# EAGLE design BUZZI-37 (EAGLE 4.15)
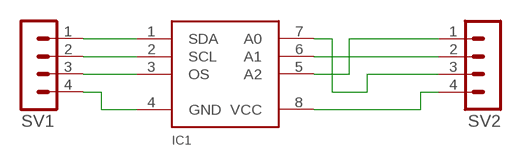
[diagram p0: schematic, sheet 1]

## Parts
IC1  SE95  [MSOP8]
SV1  MA04-1  [MA04-1]
SV2  MA04-1  [MA04-1]

## Nets
N$1: IC1.1(SDA) SV1.1
N$2: IC1.2(SCL) SV1.2
N$3: IC1.3(OS) SV1.3
N$4: IC1.4(GND) SV1.4
N$5: IC1.5(A2) SV2.1
N$6: IC1.6(A1) SV2.2
N$7: IC1.7(A0) SV2.3
N$8: IC1.8(VCC) SV2.4

## Library data of the parts
IC1 = turbod3:SE95
SV1 SV2 = con-lstb:MA04-1: PIN HEADER

## Board
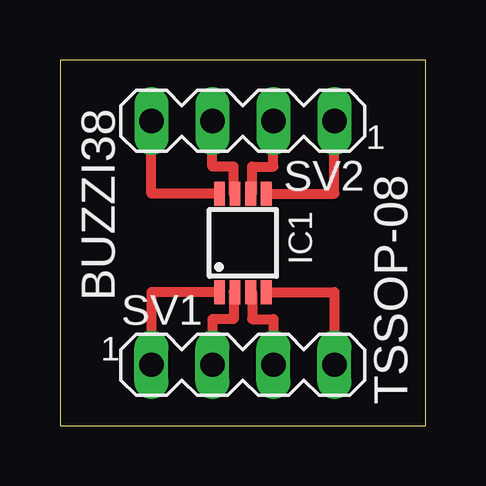
[diagram p1: board, top side]

Size 15.24 x 15.24 mm. Coordinates in mm from the lower left corner, seen from the top.
Outline: 0,0 15.24,0 15.24,15.24 0,15.24 0,0
Copper layers (1*16): Top 0.035mm / dielectric 1.5mm / Bottom 0.035mm
Design rules "PCB-POOL": minimum track width 6mil, minimum drill 12mil, track to track 6mil, track to pad 6mil, pad to pad 6mil, via to via 6mil, smd to smd 6mil, copper to edge 20mil, drill to drill 8mil, minimum pad ring 8mil, minimum via ring 6mil, stop-mask expansion 3mil, vias tented up to drill 0mil, thermal gap 8mil

### Footprints (pad centres in the part's own frame; a part is rotated, then mirrored left to right if it is on the bottom)
MSOP8 = smd 0.45 x 1: 1 -0.975,-2.05; 2 -0.325,-2.05; 3 0.325,-2.05; 4 0.975,-2.05; 5 0.975,2.05; 6 0.325,2.05; 7 -0.325,2.05; 8 -0.975,2.05
MA04-1 = drill 1.016 long: 1 -3.81,0; 2 -1.27,0; 3 1.27,0; 4 3.81,0

### Placement (x,y rotation side)
IC1  7.62,7.62 0 top
SV1  7.62,2.54 0 top
SV2  7.62,12.7 180 top

### Tracks (layer width: path | path; a pad name or v marks a point on that pad's centre or on a via)
N$1
  Top 0.406: 3.81,2.29 SV1.1 3.81,5.57 IC1.1
N$2
  Top 0.406: IC1.2 7.24,5.57 7.24,4.45 6.35,4.45 SV1.2
N$3
  Top 0.406: IC1.3 8,5.57 8,4.45 8.89,4.45 SV1.3
N$4
  Top 0.406: IC1.4 11.43,5.57 SV1.4
N$5
  Top 0.406: IC1.5 11.43,9.67 SV2.1
N$6
  Top 0.406: IC1.6 8,9.67 8,10.79 8.89,10.79 SV2.2
N$7
  Top 0.406: IC1.7 7.24,9.67 7.24,10.79 6.35,10.79 SV2.3
N$8
  Top 0.406: IC1.8 3.81,9.67 SV2.4

### Text on the board
tPlace: BUZZI38 | TSSOP-08